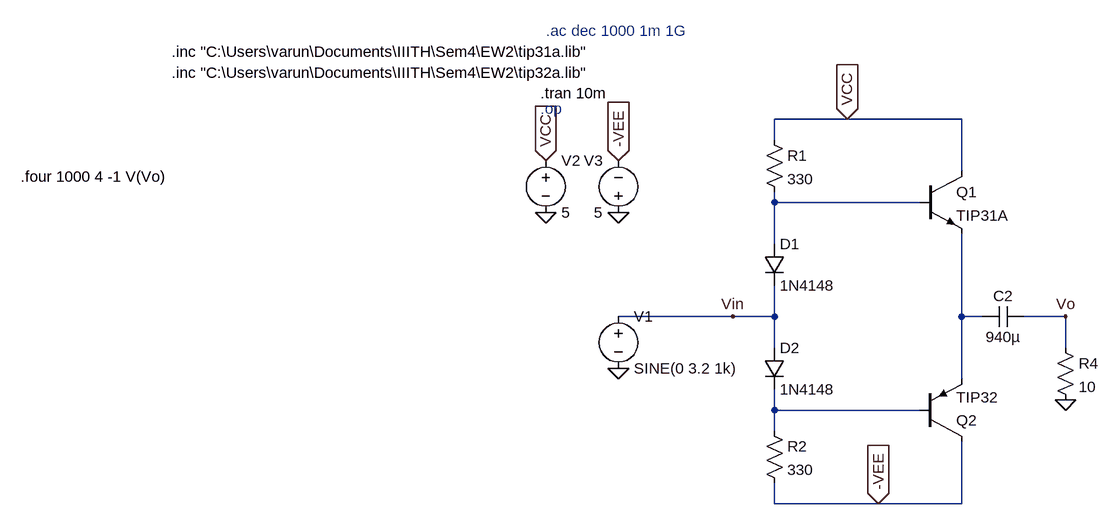
[diagram p0: schematic finalPowerAmp2.asc]
finalPowerAmp2.asc, the LTspice schematic file:
Version 4
SHEET 1 988 680
WIRE 240 -544 128 -544
WIRE 416 -544 240 -544
WIRE 128 -512 128 -544
WIRE 416 -464 416 -544
WIRE 128 -416 128 -432
WIRE 352 -416 128 -416
WIRE 128 -352 128 -416
WIRE 64 -240 -112 -240
WIRE 128 -240 128 -288
WIRE 128 -240 64 -240
WIRE 416 -240 416 -368
WIRE 448 -240 416 -240
WIRE 576 -240 512 -240
WIRE 128 -192 128 -240
WIRE 576 -192 576 -240
WIRE 416 -144 416 -240
WIRE 128 -96 128 -128
WIRE 352 -96 128 -96
WIRE 128 -64 128 -96
WIRE 128 48 128 16
WIRE 288 48 128 48
WIRE 416 48 416 -48
WIRE 416 48 288 48
FLAG 576 -112 0
FLAG 576 -240 Vo
FLAG -112 -400 0
FLAG -224 -400 0
FLAG -224 -480 VCC
IOPIN -224 -480 In
FLAG -112 -480 -VEE
IOPIN -112 -480 In
FLAG 240 -544 VCC
IOPIN 240 -544 In
FLAG 288 48 -VEE
IOPIN 288 48 In
FLAG -112 -160 0
FLAG 64 -240 Vin
SYMBOL diode 112 -352 R0
SYMATTR InstName D1
SYMATTR Value 1N4148
SYMBOL diode 112 -192 R0
SYMATTR InstName D2
SYMATTR Value 1N4148
SYMBOL res 112 -528 R0
SYMATTR InstName R1
SYMATTR Value 330
SYMBOL res 112 -80 R0
SYMATTR InstName R2
SYMATTR Value 330
SYMBOL npn 352 -464 R0
SYMATTR InstName Q1
SYMATTR Value TIP31A
SYMBOL pnp 352 -48 M180
SYMATTR InstName Q2
SYMATTR Value TIP32
SYMBOL res 560 -208 R0
SYMATTR InstName R4
SYMATTR Value 10
SYMBOL voltage -224 -496 R0
SYMATTR InstName V2
SYMATTR Value 5
SYMBOL voltage -112 -384 R180
WINDOW 0 24 96 Left 2
WINDOW 3 24 16 Left 2
SYMATTR InstName V3
SYMATTR Value 5
SYMBOL cap 512 -256 R90
WINDOW 0 0 32 VBottom 2
WINDOW 3 32 32 VTop 2
SYMATTR InstName C2
SYMATTR Value 940µ
SYMBOL voltage -112 -256 R0
WINDOW 123 24 40 Left 2
WINDOW 39 0 0 Left 0
SYMATTR InstName V1
SYMATTR Value SINE(0 3.2 1k)
TEXT -232 -584 Left 2 !.tran 10m
TEXT -800 -616 Left 2 !.inc "C:\\Users\\varun\\Documents\\IIITH\\Sem4\\EW2\\tip32a.lib"
TEXT -800 -648 Left 2 !.inc "C:\\Users\\varun\\Documents\\IIITH\\Sem4\\EW2\\tip31a.lib"
TEXT -224 -680 Left 2 ;.ac dec 1000 1m 1G
TEXT -232 -560 Left 2 ;.op
TEXT -1032 -456 Left 2 !.four 1000 4 -1 V(Vo)

The netlist it stands for:
* finalPowerAmp2.asc
D1 N001 Vin 1N4148
D2 Vin N003 1N4148
R1 VCC N001 330
R2 N003 -VEE 330
Q1 VCC N001 N002 0 TIP31A
Q2 -VEE N003 N002 0 TIP32
R4 Vo 0 10
V2 VCC 0 5
V3 0 -VEE 5
C2 Vo N002 940µ
V1 Vin 0 SINE(0 3.2 1k)
.model D D
.lib standard.dio
.model NPN NPN
.model PNP PNP
.lib standard.bjt
.tran 10m
.inc "C:\Users\varun\Documents\IIITH\Sem4\EW2\tip32a.lib"
.inc "C:\Users\varun\Documents\IIITH\Sem4\EW2\tip31a.lib"
* .ac dec 1000 1m 1G
* .op
.four 1000 4 -1 V(Vo)
.backanno
.end